# Altium project PCB_Project_Demo.PrjPcb
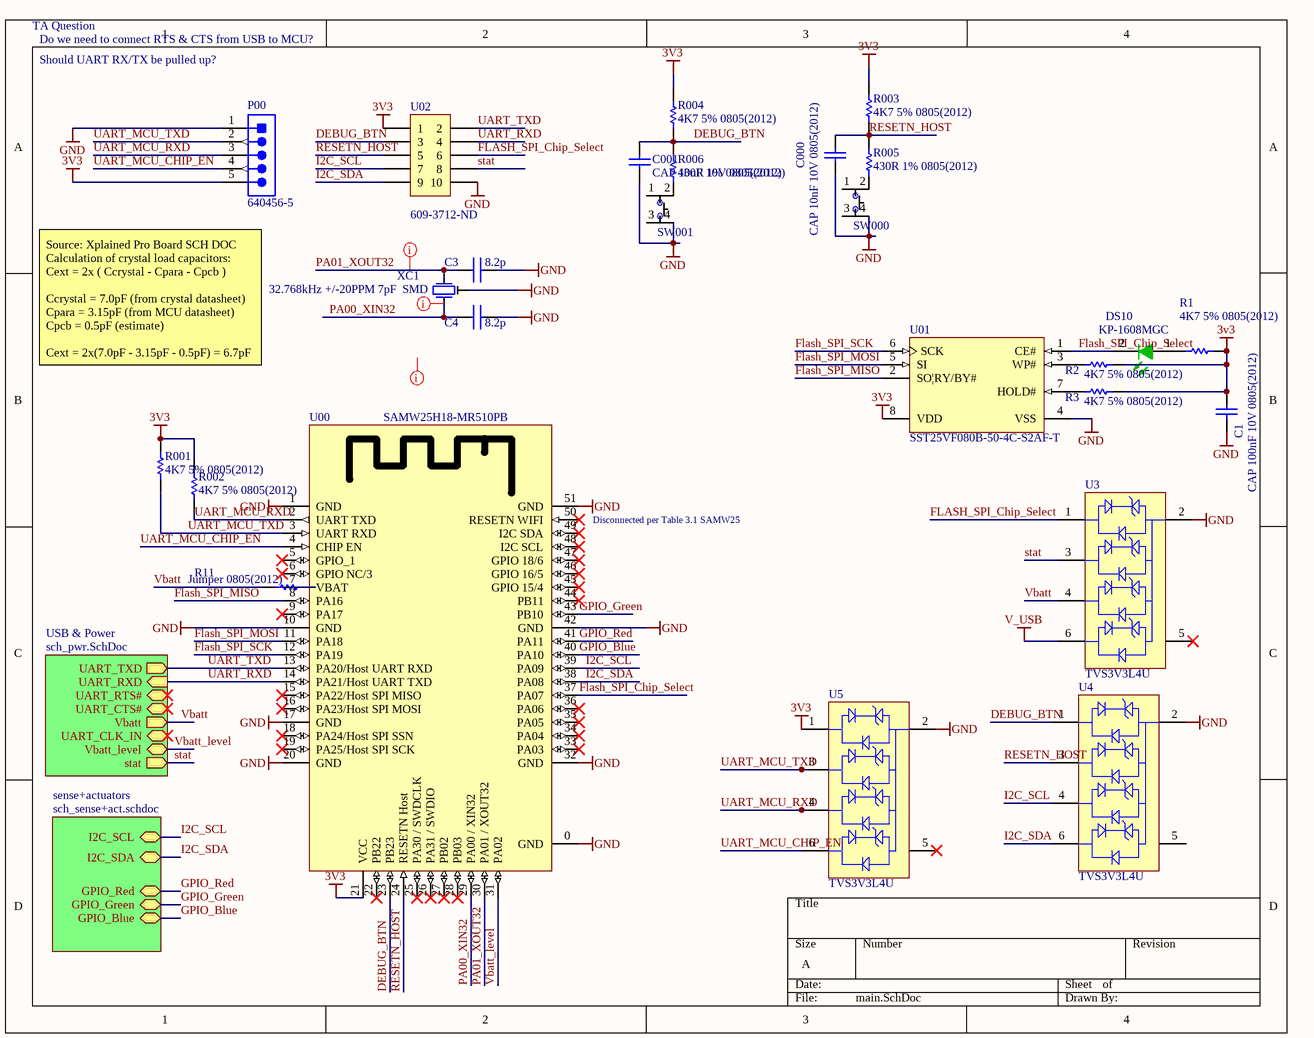
[diagram p0: main.SchDoc]
3 sheets, 60 parts. Net scope: hierarchical (ports join the sheet entries above them; power ports are global).
Sheets:
  main.SchDoc
    USB & Power = sch_pwr.SchDoc
    sense+actuators = sch_sense+act.SchDoc

## Sheet main.SchDoc
size A

### Parts
C000  CAP 10nF 10V 0805(2012)  [CAPC0805(2012)75_L]
C1  CAP 100nF 10V 0805(2012)  [CAPC0805(2012)100_N]
C001  CAP 10nF 10V 0805(2012)  [CAPC0805(2012)75_L]
C3  value 8.2p  [AP1-00001]  (hidden comment: CAP-NONPOL)
C4  value 8.2p  [AP1-00001]  (hidden comment: CAP-NONPOL)
DS10  KP-1608MGC  [KING-0603LED_GREEN_V]
P00  640456-5  [TECO-640456-5]
R001  4K7 5% 0805(2012)  [RESC0805(2012)_N]
R1  4K7 5% 0805(2012)  [RESC0805(2012)_N]
R002  4K7 5% 0805(2012)  [RESC0805(2012)_N]
R2  4K7 5% 0805(2012)  [RESC0805(2012)_N]
R003  4K7 5% 0805(2012)  [RESC0805(2012)_N]
R3  4K7 5% 0805(2012)  [RESC0805(2012)_N]
R004  4K7 5% 0805(2012)  [RESC0805(2012)_N]
R005  430R 1% 0805(2012)  [RESC0805(2012)_L]
R006  430R 1% 0805(2012)  [RESC0805(2012)_L]
R11  Jumper 0805(2012)  [RESC0805(2012)_N]
SW000  TL3300DF260Q  [TL3300DF260Q]  (value not drawn)
SW001  TL3300DF260Q  [TL3300DF260Q]  (value not drawn)
U00  SAMW25H18-MR510PB  [SAMW25H18-MR510PB]
U01  SST25VF080B-50-4C-S2AF-T  [MCHP-SOIC-S2A8_N]
U02  Supplier Part Number 1: 609-3712-ND  [20021111-00010T4LF]  (hidden comment: 20021111-00010T4LF)
U3  TVS3V3L4U  [INF-SC74_N]
U4  TVS3V3L4U  [INF-SC74_N]
U5  TVS3V3L4U  [INF-SC74_N]
XC1  value 32.768kHz +/-20PPM 7pF  SMD  [AP7-00044]  (hidden comment: Farnell order no:1539364)

### Sub-sheets
sense+actuators = sch_sense+act.schdoc: I2C_SCL (bidir), I2C_SDA (bidir), GPIO_Red (bidir), GPIO_Green (bidir), GPIO_Blue (bidir)
USB & Power = sch_pwr.SchDoc: stat (out), UART_RXD (in), UART_TXD (out), UART_RTS#, UART_CTS#, UART_CLK_IN, Vbatt_level (bidir), Vbatt (out)

### Nets
3V3: C1.1 P00.5(CTS) R001.1 R1.1 R002.1 R2.1 R003.1 R3.1 R004.1 U00.21(VCC) U01.8(VDD) U02.1 U5.1(C)
GND: C000.1 C001.1 C1.2 C3.2 C4.2 P00.1(DTR) SW000.4 SW001.4 U00.0(GND) U00.1(GND) U00.10(GND) U00.17(GND) U00.20(GND) U00.32(GND) U00.42(GND) U00.51(GND) U01.4(VSS) U02.10 U3.2(C) U4.2(C) U5.2(C) XC1.3
V_USB: U3.6(C)
DEBUG_BTN: C001.2 R004.2 R006.2 U00.23(PB23) U02.3 U4.1(C)
FLASH_SPI_Chip_Select: DS10.2(K) U00.37(PA07) U01.1(CE#) U02.6 U3.1(C)
Flash_SPI_MISO: U00.8(PA16) U01.2(SO|RY/BY#)
Flash_SPI_MOSI: U00.11(PA18) U01.5(SI)
Flash_SPI_SCK: U00.12(PA19) U01.6(SCK)
GPIO_Blue: U00.40(PA10) ; sheet sense+actuators/GPIO_Blue
GPIO_Green: U00.43(PB10) ; sheet sense+actuators/GPIO_Green
GPIO_Red: U00.41(PA11) ; sheet sense+actuators/GPIO_Red
I2C_SCL: U00.39(PA09) U02.7 U4.4(C) ; sheet sense+actuators/I2C_SCL
I2C_SDA: U00.38(PA08) U02.9 U4.6(C) ; sheet sense+actuators/I2C_SDA
PA00_XIN32: C4.1 U00.29(PA00_/_XIN32) XC1.2
PA01_XOUT32: C3.1 U00.30(PA01_/_XOUT32) XC1.1
RESETN_HOST: C000.2 R003.2 R005.2 U00.24(RESETN_Host) U02.5 U4.3(C)
stat: U02.8 U3.3(C) ; sheet USB & Power/stat
UART_MCU_CHIP_EN: P00.4(VCC) U00.4(CHIP_EN) U5.6(C)
UART_MCU_RXD: P00.3(TXO) R002.2 U00.2(UART_TXD) U5.4(C)
UART_MCU_TXD: P00.2(RXI) R001.2 U00.3(UART_RXD) U5.3(C)
UART_RXD: U00.14(PA21/Host_UART_TXD) U02.4 ; sheet USB & Power/UART_RXD
UART_TXD: U00.13(PA20/Host_UART_RXD) U02.2 ; sheet USB & Power/UART_TXD
Vbatt: R11.1 U3.4(C) ; sheet USB & Power/Vbatt
Vbatt_level: U00.31(PA02) ; sheet USB & Power/Vbatt_level
NetR2_2: R2.2 U01.3(WP#)
NetR3_2: R3.2 U01.7(HOLD#)
NetR005_1: R005.1 SW000.2
NetR006_1: R006.1 SW001.2
NetR11_2: R11.2 U00.7(VBAT)

Not connected (* = marked no-connect by the designer): DS10 1(A); R1 2; SW000 1 3; SW001 1 3; U00 5(GPIO_1)* 6(GPIO_NC/3)* 9(PA17)* 15(PA22/Host_SPI_MISO)* 16(PA23/Host_SPI_MOSI)* 18(PA24/Host_SPI_SSN)* 19(PA25/Host_SPI_SCK)* 22(PB22)* 25(PA30_/_SWDCLK)* 26(PA31_/_SWDIO)* 27(PB02)* 28(PB03)* 33(PA03)* 34(PA04)* 35(PA05)* 36(PA06)* 44(PB11)* 45(GPIO_15/4)* 46(GPIO_16/5)* 47(GPIO_18/6)* 48(I2C_SCL)* 49(I2C_SDA)* 50(RESETN_WIFI)*; U3 5(NC)*; U4 5(NC); U5 5(NC)*

### Layout directives
rule Assembly Testpoint Usage [Testpoint - Not Allowed    Multiple - Not Allowed]: (no net found under the mark), PA00_XIN32, PA01_XOUT32

### Notes on the sheet
- TA Question
- Do we need to connect RTS & CTS from USB to MCU?
- Should UART RX/TX be pulled up?
- (near P00) Source: Xplained Pro Board SCH DOC
  Calculation of crystal load capacitors:
  Cext = 2x ( Ccrystal - Cpara - Cpcb )
  Ccrystal = 7.0pF (from crystal datasheet)
  Cpara = 3.15pF (from MCU datasheet)
  Cpcb = 0.5pF (estimate)
  Cext = 2x(7.0pF - 3.15pF - 0.5pF) = 6.7pF
- (near U00) Disconnected per Table 3.1 SAMW25

### Library data of the parts
C000 C001 = CMP-1036-03812-1: CAP 10nF 10V -20% to +80% 0805 (2012 Metric) Thickness 0.75mm SMD; Case-EIA: 0805; Case-Metric: 2012; Technology: SMT; Max Thickness: 0.75 mm; Value: 10nF; Rated Voltage: 10 V; Tolerance: -20% to +80%
C1 = CMP-1036-04396-1: CAP 100nF 10V ±20% 0805 (2012 Metric) Thickness 1mm SMD; Tolerance: Â±20%; Case-Metric: 2012; Case-EIA: 0805; Rated Voltage: 10 V; Value: 100nF; Technology: SMT; Max Thickness: 1 mm
C3 C4 = A01-0014: Ceramic capacitor, SMD 0402, NP0, 50V, +/-5%; PartGroup: Capacitors,Ceramic,SMD 0402; TemperatureRange: -55 - +125 deg C; ComponentStatus: 'Active (verified)'; Status: Active; Verified by: Lars Helge Mo; Verified date: 2005-12-15; AN: A01-0014; Tolerance: 50V, +/-5%; Height: 0.550000011920929; FootprintStatus: 'Active (Verified)'
DS10 = CMP-0404-00001-1: LED, SMT, 0603(1608), 1.1mm thickness, Green; Manufacturer: Kingbright; Reverse Voltage: 5 V; Power Dissipation: 75 mW; Forward Current: 30 mA; Packing Type: 2000 pcs / reel; Mounting Technology: Surface Mount; Storage Temperature: -40 to +85 degC; ComponentLink1URL: http://www.kingbright.com/; PackageDescription: 2-Pin SMT LED, 1.6 x 0.8 mm Pitch; PartNumber: KP-1608MGC; PackageReference: 0603LED_GREEN; ComponentLink1Description: Manufacturer URL
P00 = CMP-1684-00014-1: Male Header, Pitch 2.54 mm, 1 x 5 Position, Height 10.03 mm, Tail Length 3.56 mm, / -55 to 105 degC, RoHS, Bulk; Manufacturer: TE Connectivity; Material, Housing: Polyester; Brand/Series: MTA-100Series; Color, Housing: White; Current, Rating: 5 / A; Temperature, Operating: -55to+105 / °C; Connector Type: MTA-100; Agency Approvals: CSA,UL; Material, Contact: CopperAlloy; Mounting Hole Size: 0.04 / "; Voltage, Rating: 250 / V; Contact Termination Area Plating: Tin; Pin Spacing: 0.1 / "; Primary Type: InterconnectSystem; Special Features: Pinstrip; Mount Angle: Vertical; Contact Centerline Spacing: 0.100 / in.; Number of Contacts: 5; Standards: RoHSCompliant,ELVCompliant,UL94V-0; Angle: Straight; Length, Terminal Post: 0.14 / in.; Manufacturer URL: http://www.te.com; Flammability Rating: UL94V-0; Mounting Type: PCMount; Termination: Solder; Package Reference: THD; Length, Overall: 0.5 / "; Contact Mating Area Plating: Tin; Length, Pin: 0.14 / "; Datasheet URL: http://sigma.octopart.com/77881742/technical_drawing/TE-Connectivity-640456-5.pdf; Package Description: Male Header, Pitch 2.54 mm, 1 x 5 Position, Height 10.03 mm, Tail Length 3.56 mm; Datasheet Version: Rev. W3; Contact Plating: Tin; Color: White; Number of Positions: 5; Type: PCBPlug; Contact Shape: Square; Number of Rows: 1; Size, Post: 0.025 / in.
R001 R1 R002 R2 R003 R3 R004 = CMP-1013-00090-1: 4K7 0.125W 5% 0805 (2012 Metric)  SMD; Case-EIA: 0805; Value: 4700.00 Ohm; Case-Metric: 2012; Power: 0.125 W; Tolerance: 5 %; Technology: SMT
R005 R006 = CMP-1013-00468-1: 430R 0.125W 1% 0805 (2012 Metric)  SMD; Value: 430.00 Ohm; Case-Metric: 2012; Case-EIA: 0805; Power: 0.125 W; Tolerance: 1 %; Technology: SMT
R11 = CMP-1013-00001-1: Jumper 0805 (2012 Metric); Case-EIA: 0805; Value: 0.00 Ohm; Tolerance: None; Case-Metric: 2012; Technology: SMT; Power: None
SW000 SW001 = TL3300DF260Q: SWITCH TACTILE SPST-NO 0.05A 12V; Manufacturer: E-Switch; Mechanical Life: 100000Cycles; Operating Force: 260gf; Current Rating: 50mA; Illumination Type: Non-Illuminated; Throw Configuration: SPST; Switch Travel: 0.35mm; Supplier 1: Digi-Key; Manufacturer Part Number: TL3300DF260Q; Stock 1: 7332; Pricing 1: 1=0.55, 10=0.529, 25=0.5188, 50=0.4992, 100=0.4308, 250=0.3916 (USD); Case/Package: SMD/SMT; Contact Plating: Silver; Min Operating Temperature: -25°C; Max Operating Temperature: 70°C; Package Quantity: 1; Packaging: Tape and Reel; Voltage Rating (DC): 12V; Termination: Gull Wing; Lead Free: Lead Free; ComponentLink1URL: https://datasheet.ciiva.com/2901/n301104-2901040.pdf; ComponentLink1Description: https://datasheet.ciiva.com/2901/n301104-2901040.pdf; Supplier Part Number 1: EG4907CT-ND
U00 = SAMW25H18-MR510PB: RF TXRX MODULE WIFI TRACE ANT; Manufacturer: Atmel; Manufacturer Part Number: ATSAMW25H18-MR510PB; Protocol: 802.11b/g/n; Frequency: 2.4GHz; Data Rate: 65Mbps; Power - Output: 17dBm; Sensitivity: -95.5dBm; Serial Interfaces: SPI, UART; Antenna Type: Integrated, Trace; Memory Size: 256kB Flash, 32kB SRAM; Voltage - Supply: 2.7 V ~ 4.2 V; Category: RF/IF and RFID; Family: RF Transceiver Modules; Series: Xplained Pro; Packaging: Tray; RF Family/Standard: WiFi; Modulation: -; Current - Receiving: -; Current - Transmitting: -; Mounting Type: Surface Mount; Operating Temperature: -40°C ~ 85°C; Package / Case: Module; ComponentLink1URL: http://www.atmel.com/devices/ATSAMW25.aspx; ComponentLink1Description: http://www.atmel.com/devices/ATSAMW25.aspx; ComponentLink2URL: http://www.farnell.com/datasheets/1965115.pdf; ComponentLink2Description: http://www.farnell.com/datasheets/1965115.pdf; Supplier 1: Digikey; Stock 1: 120; Pricing 1: 1=19.14 (USD); Supplier Part Number 1: ATSAMW25H18-MR510PB-ND
U01 = CMP-0378-00054-1: 8 Mbit SPI Serial Flash, 2.7 to 3.6 V, 50 MHz, 0 to 70 degC, 8-pin SOIC (S2A8), Tape and Reel; Manufacturer: Microchip; Mounting Technology: Surface Mount; ComponentLink2Description: Datasheet; PackageDescription: 8-Lead Plastic Small Outline Intergrated Circuit, 5.275 x 5.275 mm Body, 1.27 mm Pitch; DatasheetVersion: Rev. A; ComponentLink1Description: Manufacturer URL; PackageVersion: Rev. A; ComponentLink3Description: Package Specification; PackageReference: SOIC-S2A8; ComponentLink3URL: http://ww1.microchip.com/downloads/en/DeviceDoc/25051A.pdf; ComponentLink4Description: Product URL; ComponentLink2URL: http://ww1.microchip.com/downloads/en/DeviceDoc/25045A.pdf; PartNumber: SST25VF080B-50-4C-S2AF-T; ComponentLink4URL: http://www.microchip.com/SST25VF080B; ComponentLink1URL: http://www.microchip.com
U02 = 20021111-00010T4LF: CONN HEADER 10POS UNSHD VERT T/H; Manufacturer: Amphenol / FCI; Stack Height: 2.5 mm; Number of Positions / Contacts: 10; Brand: FCI; Pitch: 1.27 mm; Mounting Angle: Vertical; Current Rating: 10 A; Mating Post Length: 3.05 mm; Voltage Rating: 125 V; Manufacturer Part Number: 20021111-00010T4LF; Mounting Style: Through Hole; Product Category: Headers & Wire Housings; RoHS: Details; Series: Minitek; Product Type: Headers; Type: Unshrouded; Number of Positions: 10; Number of Rows: 2; Contact Plating: Gold; Housing Material: Plastic; Termination Style: Through Hole; Contact Material: Nickel; Packaging: Tube; Factory Pack Quantity: 93; Termination Post Length: 2.3 mm; ComponentLink1URL: https://datasheet.ciiva.com/1433/1079612-1433267.pdf; ComponentLink1Description: https://datasheet.ciiva.com/1433/1079612-1433267.pdf; ComponentLink2URL: https://datasheet.ciiva.com/409/20021111-409158.pdf; ComponentLink2Description: https://datasheet.ciiva.com/409/20021111-409158.pdf; ComponentLink3URL: https://datasheet.ciiva.com/5131/20021111-5131386.pdf; ComponentLink3Description: https://datasheet.ciiva.com/5131/20021111-5131386.pdf; ComponentLink4URL: https://datasheet.ciiva.com/9465/20021111-9465402.pdf; ComponentLink4Description: https://datasheet.ciiva.com/9465/20021111-9465402.pdf; Supplier 1: Digi-Key
U3-U5 = CMP-1179-00001-1: Low Capacitance ESD / Transient / Surge Protection Array, -55 to 125 degC, SC74, Reel, Green; Manufacturer: Infineon; VESD (max): 30Â kV; VESD (min): -30Â kV; CL (typ): 2Â pF; CL (max): 3Â pF; IR (max): 50Â uA; IEFT: 80 A; VRWM: 3.3Â V; Green: TRUE; Rdyn typ reverse: 9Â Ohm; Rdyn typ forward: 0.12Â Ohm; ComponentLink2Description: Datasheet; Mounting Technology: Surface Mount; ComponentLink3Description: Package Specification; ComponentLink2URL: http://www.infineon.com/dgdl/TVS3V3L4U_rev_2_2.pdf?folderId=db3a30431f848401011fcbf2ab4c04c4&fileId=db3a3043382e837301385be7912532ed; ComponentLink1Description: Manufacturer URL; PackageDescription: 6-Pin Semiconductor Package, 2.9 x 1.6 mm Body, 0.95 mm Pitch; ComponentLink3URL: http://www.infineon.com/dgdl/SC74-Package_Overview.pdf?folderId=db3a30431936bc4b01194dec844f40d9&fileId=db3a30431936bc4b01195175d46e3ab3; PackageVersion: Apr-08; DatasheetVersion: Rev. 2.2; ComponentLink1URL: http://www.infineon.com/; Packing: Reel; PackageReference: SC74; PartNumber: TVS3V3L4U
XC1 = A07-0052: 32k768 crystal, +-20ppm, CL=7pF, max ESR 60kOhm, SMD; PartGroup: Frequency devices,Crystals,SMD; Manufacturer: Micro Crystal; MPN: MS1V-T1K 32.768kHz 7pF +/-20PPM TA; Tolerance: +/- 20 PPM; TemperatureRange: -40 /+85; ComponentStatus: 'Active (verified)'; AN: A07-0052; Height: 2,07999992370605; FootprintStatus: 'Active (Verified)'

## Sheet sch_pwr.SchDoc
size A
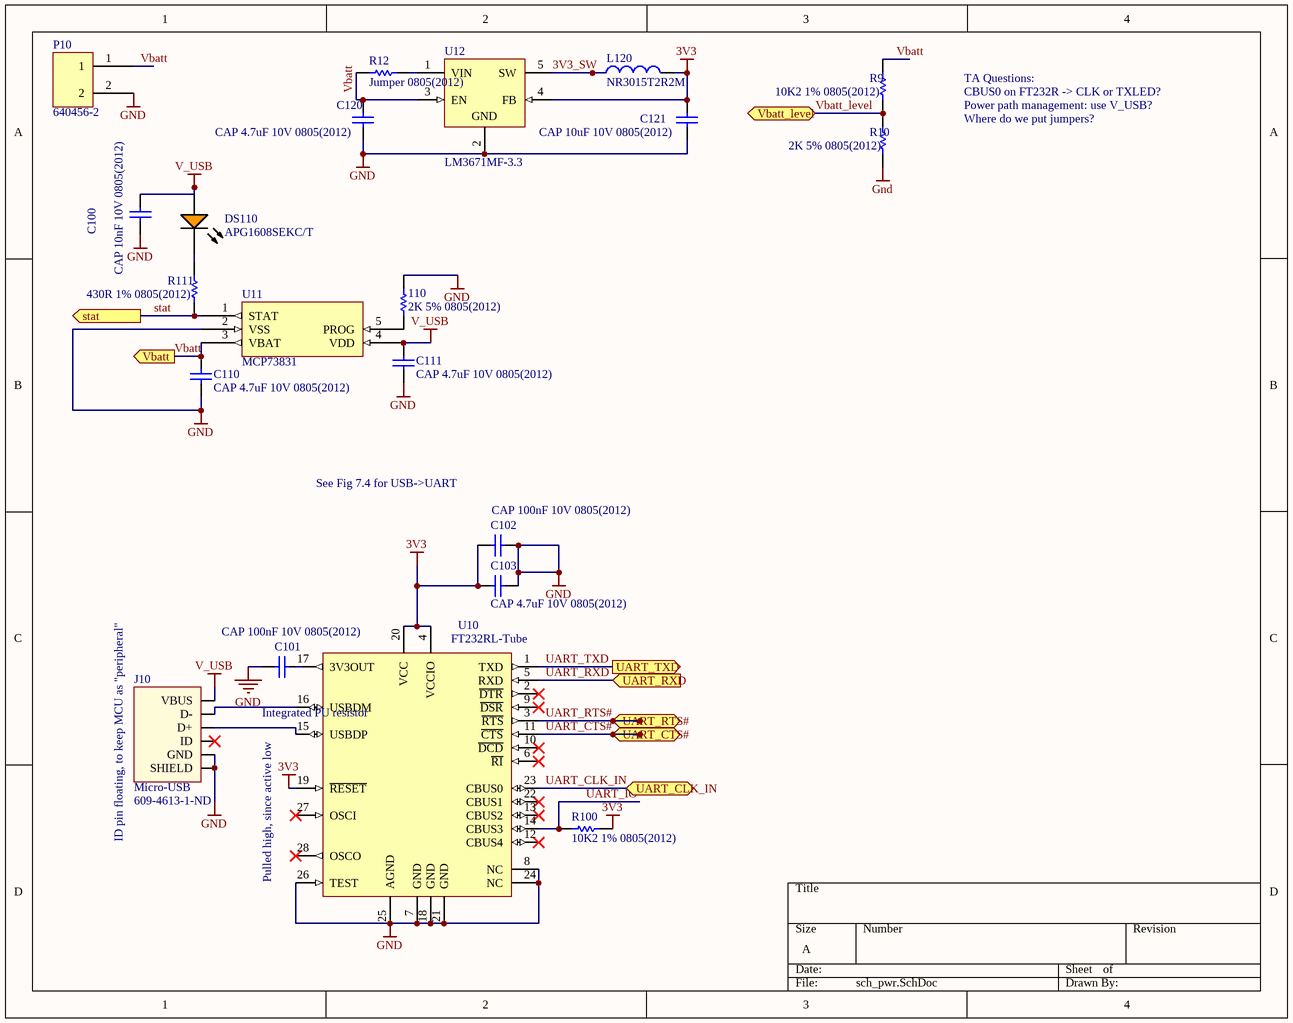
[diagram p1: sch_pwr.SchDoc]

### Parts
110  2K 5% 0805(2012)  [RESC0805(2012)_N]
C100  CAP 10nF 10V 0805(2012)  [CAPC0805(2012)75_L]
C101  CAP 100nF 10V 0805(2012)  [CAPC0805(2012)100_N]
C102  CAP 100nF 10V 0805(2012)  [CAPC0805(2012)100_N]
C103  CAP 4.7uF 10V 0805(2012)  [CAPC0805(2012)155_L]
C110  CAP 4.7uF 10V 0805(2012)  [CAPC0805(2012)155_L]
C111  CAP 4.7uF 10V 0805(2012)  [CAPC0805(2012)155_L]
C120  CAP 4.7uF 10V 0805(2012)  [CAPC0805(2012)155_L]
C121  CAP 10uF 10V 0805(2012)  [CAPC0805(2012)145_N]
DS110  APG1608SEKC/T  [KING-LED0603-25-ORANGE_V]
J10  Micro-USB  Supplier Part Number 1: 609-4613-1-ND  [10118192-0001LF]
L120  NR3015T2R2M  [TAYO-IND0315_V]
P10  640456-2  [640456-2]
R9  10K2 1% 0805(2012)  [RESC0805(2012)_L]
R10  2K 5% 0805(2012)  [RESC0805(2012)_N]
R12  Jumper 0805(2012)  [RESC0805(2012)_N]
R100  10K2 1% 0805(2012)  [RESC0805(2012)_L]
R111  430R 1% 0805(2012)  [RESC0805(2012)_L]
U10  FT232RL-Tube  [SSOP-28_N]
U11  MCP73831  [MCP73831-SOT23]
U12  LM3671MF-3.3  [MF05A_N]

### Ports
stat (out), UART_CLK_IN (bidir), UART_CTS# (in), UART_RTS# (out), UART_RXD (in), UART_TXD (out), Vbatt (out), Vbatt_level

### Nets
3V3: C102.2 C103.2 C121.1 L120.2 R100.2 U10.4(VCCIO) U10.19(~{RESET}) U10.20(VCC) U12.4(FB)
GND: 110.2 C100.1 C101.1 C102.1 C103.1 C110.2 C111.1 C120.1 C121.2 J10.5(GND) J10.6(SHIELD) P10.2 R10.1 U10.7(GND) U10.8(NC) U10.18(GND) U10.21(GND) U10.24(NC) U10.25(AGND) U10.26(TEST) U11.2(VSS) U12.2(GND)
V_USB: C100.2 C111.2 DS110.1(A) J10.1(VBUS) U11.4(VDD)
3V3_SW: L120.1 U12.5(SW)
stat: R111.1 U11.1(STAT) ; port stat
UART_CLK_IN: U10.23(CBUS0) ; port UART_CLK_IN
UART_CTS#: U10.11(~{CTS}) ; port UART_CTS#
UART_IO: R100.1 U10.14(CBUS3)
UART_RTS#: U10.3(~{RTS}) ; port UART_RTS#
UART_RXD: U10.5(RXD) ; port UART_RXD
UART_TXD: U10.1(TXD) ; port UART_TXD
Vbatt: C110.1 C120.2 P10.1 R9.2 R12.1 U11.3(VBAT) U12.3(EN) ; port Vbatt
Vbatt_level: R9.1 R10.2 ; port Vbatt_level
Net110_1: 110.1 U11.5(PROG)
NetC101_2: C101.2 U10.17(3V3OUT)
NetDS110_2: DS110.2(K) R111.2
NetJ10_2: J10.2(D-) U10.16(USBDM)
NetJ10_3: J10.3(D+) U10.15(USBDP)
NetR12_2: R12.2 U12.1(VIN)

Not connected (* = marked no-connect by the designer): J10 4(ID)*; U10 2(~{DTR})* 6(~{RI})* 9(~{DSR})* 10(~{DCD})* 12(CBUS4)* 13(CBUS2)* 22(CBUS1)* 27(OSCI)* 28(OSCO)*

### Notes on the sheet
- CBUS0 on FT232R -> CLK or TXLED?
- TA Questions:
- Power path management: use V_USB?
- Where do we put jumpers?
- See Fig 7.4 for USB->UART
- (near U10) Integrated PU resistor
- ID pin floating, to keep MCU as "peripheral"
- Pulled high, since active low

### Library data of the parts
110 R10 = CMP-1013-00081-1: 2K 0.125W 5% 0805 (2012 Metric)  SMD; Case-EIA: 0805; Value: 2000.00 Ohm; Case-Metric: 2012; Technology: SMT; Tolerance: 5 %; Power: 0.125 W
C100 = CMP-1036-03812-1: as C000 on sheet main; Technology: SMT; Max Thickness: 0.75 mm; Value: 10nF; Rated Voltage: 10 V; Tolerance: -20% to +80%
C101 C102 = CMP-1036-04396-1: as C1 on sheet main; Rated Voltage: 10 V; Value: 100nF; Technology: SMT; Max Thickness: 1 mm
C103 C110 C111 C120 = CMP-1036-04882-1: CAP 4.7uF 10V ±10% 0805 (2012 Metric) Thickness 1.55mm SMD; Case-EIA: 0805; Tolerance: Â±10%; Case-Metric: 2012; Rated Voltage: 10 V; Max Thickness: 1.55 mm; Technology: SMT; Value: 4.7uF
C121 = CMP-1036-04922-1: CAP 10uF 10V ±10% 0805 (2012 Metric) Thickness 1.45mm SMD; Tolerance: Â±10%; Case-EIA: 0805; Case-Metric: 2012; Value: 10uF; Technology: SMT; Rated Voltage: 10 V; Max Thickness: 1.45 mm
DS110 = CMP-0239-00002-1: LED, SMT, 0603(1608), 0.25mm Tthickness, Super Bright Orange; Forward Current: 30 mA; Power Dissipation: 75 mW; Reverse Voltage: 5 V; Packing: Reel; PackageDescription: 2-Pin SMT LED, 1.6 x 0.8 mm Body, 0.25mm Thickness; ComponentLink1URL: http://www.kingbrightusa.com/; PackageVersion: Rev. 4A, 12/2011; Storage Temperature: -40 to 85 degC; PartNumber: APG1608SEKC/T; Mounting Technology: Surface Mount; ComponentLink2Description: Datasheet; DatasheetVersion: Rev. 4A, 12/2011; ComponentLink2URL: http://www.kingbrightusa.com/images/catalog/SPEC/APG1608SEKC-T.pdf; PackageReference: LED0603-25-ORANGE; ComponentLink1Description: Manufacturer URL
J10 = 10118192-0001LF: CONN USB MICRO B RECPT SMT R/A; HelpURL: http://portal.fciconnect.com/Comergent//fci/drawing/10118192.pdf; Supplier 1: Digi-Key
L120 = CMP-0569-00001-2: SMD Power Inductor, 2.2 uH, +/- 20%, 3 x 3 x 1.5 mm, -25 to 120 degC, Pb-Free, Tape and Reel; Manufacturer: Taiyo Yuden; Inductance: 2.2 uH (+/-20%); Rated Current-Temperature Rise Current: 1500 mA; DC Resistance (max): 0.072 Ohm; Rated Current-Saturation Current: 1480 mA; Inductance Measuring Frequency: 100 kHz; Self-Resonant Frequency (min): 64 MHz; Avg. of DC. Resistance: 0.06 Ohm; Soldering Method: Reflow; Temperature Range: -25 to 120 degC; ComponentLink1Description: Manufacturer URL; Mounting Technology: Surface Mount; Halogen Free: TRUE; ComponentLink1URL: www.yuden.co.jp; Packing: Tape and Reel; DatasheetVersion: 1/11/2013; PackageDescription: 2-Pin SMT Inductor, Body 3 x 3 mm; ComponentLink2URL: http://www.yuden.co.jp/ut/product/category/inductor/NR3015T2R2M.pdf; PartNumber: NR3015T2R2M; RoHS Compliance: TRUE; PackageReference: IND3015; ComponentLink2Description: Datasheet; Case Size: 3015
P10 = 640456-2: CONN HEADER VERT 2POS .100 TIN; Manufacturer: TE Connectivity; Underplate Material: Nickel; Connector Type: Plug,Pin,Header; Contact Resistance: 6mR; Max Current Rating: 5A; Max Voltage Rating (AC): 250V; Number of Positions: 2; Backwall/Post Interruptions: No (Without); Connector System: Wire-to-Board; Plating Thickness: 3.81um; PCB Mount Retention: Without; Gender: Male; Contact Style: Straight; PCB Mounting Orientation: Vertical; Pitch: 2.54mm; Mating Post Length: 7.49mm; PCB Thickness: 0.063inch; Tail Length: 3.56mm; Approvals: CSA; Supplier 1: Digi-Key; Manufacturer Part Number: 640456-2; Stock 1: 141304; Pricing 1: 1=0.12, 10=0.117, 100=0.0724, 500=0.0599, 1000=0.0524, 5000=0.0449, 10000=0.0437 (USD); Mount: Through Hole; Colour: White,Natural,Beige; Contact Plating: Tin; Contact Material: Copper Alloy; Housing Colour: Natural; Housing Material: Polyester; Contact Shape: Square; Min Operating Temperature: -67°C; Max Operating Temperature: 221°C; Package Quantity: 5000; Packaging: Bulk; Termination: Solder; Number of Rows: 1; Fastening Type: Friction; Contact Gender: Male; Voltage Rating (AC): 250V; Number of Contacts: 2; Orientation: Straight; Contact Retention: No (Without); Mating Alignment: No (Without); Mating Retention: No (Without); PCB Mount Alignment: No (Without); Panel Mount Retention: No (Without); Sealable: No (Without); Strain Relief: No (Without); Current Rating: 5A; Number of Poles: 2; Voltage Rating: 250V; Working Voltage: 250V; Length: 5.08mm; Height: 7.87mm; Depth: 5.72mm; Lead Pitch: 2.54mm; Contact Mating Length: 0.295inch; Termination Post Length: 3.56mm; Radiation Hardening: No; ELV: Compliant; Lead Free: Lead Free; Flammability Rating: UL94 V-0; REACH SVHC: No SVHC; ComponentLink1URL: https://datasheet.ciiva.com/709/eng-cd-640456-w1-709680.pdf; ComponentLink1Description: https://datasheet.ciiva.com/709/eng-cd-640456-w1-709680.pdf; ComponentLink2URL: https://datasheet.ciiva.com/3118/eng-ds-82056-mta-0608-3118497.pdf; ComponentLink2Description: https://datasheet.ciiva.com/3118/eng-ds-82056-mta-0608-3118497.pdf; ComponentLink3URL: https://datasheet.ciiva.com/19462/613931-19462481.pdf; ComponentLink3Description: https://datasheet.ciiva.com/19462/613931-19462481.pdf; ComponentLink4URL: https://datasheet.ciiva.com/14156/04384301-14156820.pdf; ComponentLink4Description: https://datasheet.ciiva.com/14156/04384301-14156820.pdf; ComponentLink5URL: https://datasheet.ciiva.com/7128/1866390-7128742.pdf; ComponentLink5Description: https://datasheet.ciiva.com/7128/1866390-7128742.pdf; ComponentLink6URL: https://datasheet.ciiva.com/16401/eng-ds-82056-mta-0608-16401289.pdf; ComponentLink6Description: https://datasheet.ciiva.com/16401/eng-ds-82056-mta-0608-16401289.pdf; ComponentLink7URL: https://datasheet.ciiva.com/16505/eng-ds-82056-mta-0608-16505419.pdf; ComponentLink7Description: https://datasheet.ciiva.com/16505/eng-ds-82056-mta-0608-16505419.pdf; ComponentLink8URL: https://datasheet.ciiva.com/25617/0900766b80027008-25617244.pdf; ComponentLink8Description: https://datasheet.ciiva.com/25617/0900766b80027008-25617244.pdf; ComponentLink9URL: https://datasheet.ciiva.com/11746/0900766b80eb7fdd-11746365.pdf; ComponentLink9Description: https://datasheet.ciiva.com/11746/0900766b80eb7fdd-11746365.pdf; Supplier Part Number 1: A1921-ND
R9 R100 = CMP-1013-00624-1: 10K2 0.125W 1% 0805 (2012 Metric)  SMD; Case-Metric: 2012; Case-EIA: 0805; Value: 10200.00 Ohm; Technology: SMT; Tolerance: 1 %; Power: 0.125 W
R12 = CMP-1013-00001-1: as R11 on sheet main; Technology: SMT; Power: None
R111 = CMP-1013-00468-1: as R005 on sheet main; Power: 0.125 W; Tolerance: 1 %; Technology: SMT
U10 = CMP-0078-00028-3: USB UART Asynchronous Serial Data Transfer Chip, 28-pin SSOP, Tube; Manufacturer: FTDI; ComponentLink1Description: Manufacturer URL; ComponentLink2URL: http://www.ftdichip.com/Support/Documents/DataSheets/ICs/DS_FT232R.pdf; PackageVersion: Mar-12; PartNumber: FT232RL-Tube; RevisionNote: DatasheetVersion updated to 2.10 Mar-2012; PackageDescription: 28-Pin Small Outline Package 0.65 mm Pitch; PackageReference: SSOP-28; DatasheetVersion: ver 2.10, Mar-2012; ComponentLink2Description: Datasheet; ComponentLink1URL: http://www.ftdichip.com/
U12 = CMP-0063-01133-2: 2MHz, 600mA Step-Down DC-DC Converter, 5-pin SOT-23; Manufacturer: National Semiconductor; PackageTopMarking: SJEB*XTT; PowerWise: Y; CompType: MiscPower; ComponentLink2URL: http://www.national.com/pf/LM/LM3671.html; ComponentLink1Description: LM3671 Datasheet; ComponentLink2Description: LM3671 Web Page; PinCount: 5; PackageVersion: revD, Aug-2008; RevisionNote: Component URLs added; DatasheetVersion: Oct-2008; ComponentLink3Description: MF05A Package Page; RoHS: N; ComponentLink3URL: http://www.national.com/packaging/folders/mf05a.html; PackageReference: MF05A; ComponentLink1URL: http://www.national.com/ds/LM/LM3671.pdf; PackageDescription: Molded SOT-23, .115 x .063 x .040 in Body, 5 Lead, .0375 in Pitch

## Sheet sch_sense+act.SchDoc
size A
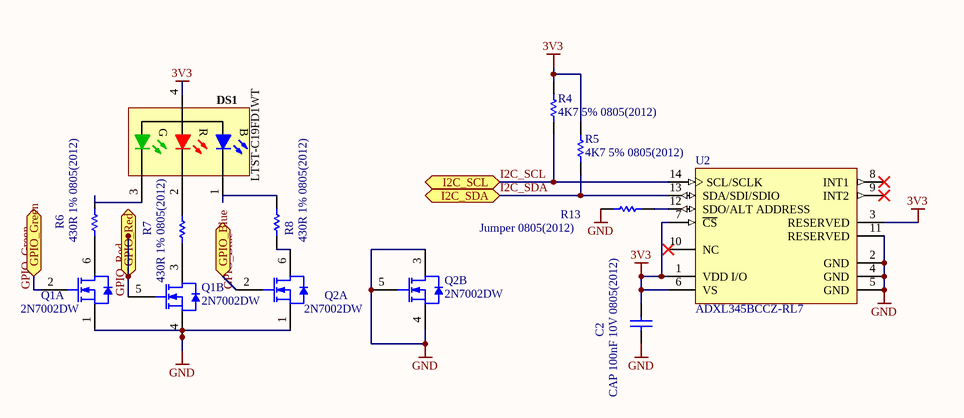
[diagram p2: sch_sense+act.SchDoc]

### Parts
(Parts that share a designator on the sheet are numbered #1, #2 ... from top to bottom, then left to right.)
C2  CAP 100nF 10V 0805(2012)  [CAPC0805(2012)100_N]
DS1  LTST-C19FD1WT  [LITO-LEDL210W160H55_V]
Q1#1  2N7002DW  [INF-PG-SOT-363_N]  (part A of 2)
Q1#2  2N7002DW  [INF-PG-SOT-363_N]  (part B of 2)
Q2#1  2N7002DW  [INF-PG-SOT-363_N]  (part A of 2)
Q2#2  2N7002DW  [INF-PG-SOT-363_N]  (part B of 2)
R4  4K7 5% 0805(2012)  [RESC0805(2012)_N]
R5  4K7 5% 0805(2012)  [RESC0805(2012)_N]
R6  430R 1% 0805(2012)  [RESC0805(2012)_L]
R7  430R 1% 0805(2012)  [RESC0805(2012)_L]
R8  430R 1% 0805(2012)  [RESC0805(2012)_L]
R13  Jumper 0805(2012)  [RESC0805(2012)_N]
U2  ADXL345BCCZ-RL7  [ADI-CC-14-1_V]

### Ports
GPIO_Blue (bidir), GPIO_Green (bidir), GPIO_Red (bidir), I2C_SCL (bidir), I2C_SDA (bidir)

### Nets
3V3: C2.1 DS1.4(A) R4.1 R5.1 U2.1(VDD_I/O) U2.3(RESERVED) U2.6(VS) U2.7(~{CS})
GND: C2.2 Q1#1.1(SOURCE_(1)) Q1#2.4(SOURCE_(2)) Q2#1.1(SOURCE_(1)) Q2#2.3(DRAIN_(2)) Q2#2.4(SOURCE_(2)) Q2#2.5(GATE_(2)) R13.1 U2.2(GND) U2.4(GND) U2.5(GND) U2.11(RESERVED)
GPIO_Blue: Q2#1.2(GATE_(1)) ; port GPIO_Blue
GPIO_Green: Q1#1.2(GATE_(1)) ; port GPIO_Green
GPIO_Red: Q1#2.5(GATE_(2)) ; port GPIO_Red
I2C_SCL: R4.2 U2.14(SCL/SCLK) ; port I2C_SCL
I2C_SDA: R5.2 U2.13(SDA/SDI/SDIO) ; port I2C_SDA
NetDS1_1: DS1.1(B) R8.2
NetDS1_2: DS1.2(R) R7.2
NetDS1_3: DS1.3(G) R6.2
NetQ1#1_6: Q1#1.6(DRAIN_(1)) R6.1
NetQ1#2_3: Q1#2.3(DRAIN_(2)) R7.1
NetQ2#1_6: Q2#1.6(DRAIN_(1)) R8.1
NetR13_2: R13.2 U2.12(SDO/ALT_ADDRESS)

Not connected (* = marked no-connect by the designer): U2 8(INT1)* 9(INT2)* 10(NC)*

### Library data of the parts
C2 = CMP-1036-04396-1: as C1 on sheet main; Rated Voltage: 10 V; Value: 100nF; Technology: SMT; Max Thickness: 1 mm
DS1 = CMP-0258-00001-1: SMD RGB Diffused; Reverse Voltage: 5 V; Forward Voltage Green: 3.5 V; Luminous Intensity Green: 280 MCD; Luminous Intensity Red: 180 MCD; Wavelength at Peak Emission Red: 611 nm; Forward Voltage Red: 2.0 V; Luminous Intensity Blue: 112 MCD; Power Dissipation Green: 80 mW; Power Dissipation Red: 75 mW; Wavelength at Peak Emission Blue: 468 nm; Wavelength at Peak Emission Green: 520 nm; PackageDescription: 4-Pin SMT LED, 2.1 x 1.6 mm Body, 0.55 mm Thickness; Mounting Technology: Suface Mount; PartNumber: LTST-C19FD1WT; LED Light Colour: RGB; PackageReference: LEDL210W160H55; ComponentLink1Description: Manufacturer URL; Power Dissipation Blue: 80 mW; ComponentLink2URL: Data Source:http://media.digikey.com/pdf/Data%20Sheets/Lite-On%20PDFs/LTST-C19FD1WT.pdf; Forward Voltage Blue: 3.5 V; ComponentLink2Description: URL Link1; ComponentLink1URL: http://www.liteon.com/
Q1#1 Q1#2 Q2#1 Q2#2 = CMP-1149-00044-1: N-Channel OptiMOS Small-Signal-Transistor, 60 V VDS, 0.3 A ID, -55 to 150 degC, PG-SOT-363, Reel, Green; Manufacturer: Infineon; ID (max): 0.3Â A; Green: TRUE; RthJA (max): 250 K/W; VDS (max): 60 V; VGS(th) (min): 1.5Â V; QG: 0.4Â nC; Ptot (max): 0.5Â W; VGS(th) (max): 2.5Â V; IDpuls (max): 1.2Â A; RDS (on) (max): 3,000 mOhm; RDS (on) (max) (@4.5V): 4,000 mOhm; PackageDescription: 6-Pin Small Outline Transistor Package, 2 x 1.25 mm Body, 0.65 mm Pitch; ComponentLink3Description: Package Specification; ComponentLink3URL: http://www.infineon.com/dgdl/SOT363-Package_Overview.pdf?folderId=db3a30431936bc4b01195360bd8f3cdc&fileId=db3a30431936bc4b0119536b62bf3cf5; ComponentLink1URL: http://www.infineon.com/; PackageVersion: Apr-08; ComponentLink2Description: Datasheet; Packing: Reel; Mounting Technology: Surface Mount; Halogen-free: TRUE; PackageReference: PG-SOT-363; ComponentLink1Description: Manufacturer URL; PartNumber: 2N7002DW; DatasheetVersion: Rev. 2.2; ComponentLink2URL: http://www.infineon.com/dgdl/2N7002DW_Rev2.2_.pdf?folderId=db3a3043156fd573011622e10b5c1f67&fileId=db3a30431a5c32f2011ad94ed41363f2
  Q1#2 Q2#2: PartId: 2
R4 R5 = CMP-1013-00090-1: as R001 on sheet main; Power: 0.125 W; Tolerance: 5 %; Technology: SMT
R6-R8 = CMP-1013-00468-1: as R005 on sheet main; Power: 0.125 W; Tolerance: 1 %; Technology: SMT
R13 = CMP-1013-00001-1: as R11 on sheet main; Technology: SMT; Power: None
U2 = CMP-0885-00033-1: 3-Axis, +/-2 g / +/-4 g / +/-8 g / +/-16 g Digital Accelerometer with Digital Output, 1.6 KHz BW, Industrial, 14-pin LGA, Reel; Manufacturer: Analog Devices; Supply Current: 140 uA; Voltage Supply (V): 2.0 to 3.6; -3dB Bandwidth: 1.6 KHz; Sensitivity: 256/128/64/32 LSB/g; # of Axes: 3; Output Type: Digital; PackageDescription: 14-Pin Land Grid Array, 3 x 5 mm Body, 0.8 mm Pitch; ComponentLink1URL: http://www.analog.com/en/index.html; ComponentLink2Description: Datasheet; PartNumber: ADXL345BCCZ-RL7; ComponentLink3Description: Package Specification; ComponentLink4URL: http://www.analog.com/en/mems-sensors/mems-inertial-sensors/adxl345/products/product.html; PackageVersion: 03-16-2010-A, 03/2010; ComponentLink1Description: Manufacturer URL; ComponentLink2URL: http://www.analog.com/static/imported-files/data_sheets/ADXL345.pdf; DatasheetVersion: Rev. D; PackageReference: CC-14-1; Packing: Reel; Mounting Technology: Surface Mount; ComponentLink4Description: Product URL; ComponentLink3URL: http://www.analog.com/static/imported-files/data_sheets/ADXL343.pdf

## Nets that join several sheets
3V3: main (13 pins), sch_pwr (9 pins), sch_sense+act (8 pins)
GND: main (22 pins), sch_pwr (22 pins), sch_sense+act (12 pins)
V_USB: main (U3.6), sch_pwr (5 pins)
GPIO_Blue: main (U00.40), sch_sense+act (Q2#1.2)
GPIO_Green: main (U00.43), sch_sense+act (Q1#1.2)
GPIO_Red: main (U00.41), sch_sense+act (Q1#2.5)
I2C_SCL: main (U00.39 U02.7 U4.4), sch_sense+act (R4.2 U2.14)
I2C_SDA: main (U00.38 U02.9 U4.6), sch_sense+act (R5.2 U2.13)
stat: main (U02.8 U3.3), sch_pwr (R111.1 U11.1)
UART_RXD: main (U00.14 U02.4), sch_pwr (U10.5)
UART_TXD: main (U00.13 U02.2), sch_pwr (U10.1)
Vbatt: main (R11.1 U3.4), sch_pwr (7 pins)
Vbatt_level: main (U00.31), sch_pwr (R9.1 R10.2)